# EAGLE design imu_v3 (EAGLE 5.11)
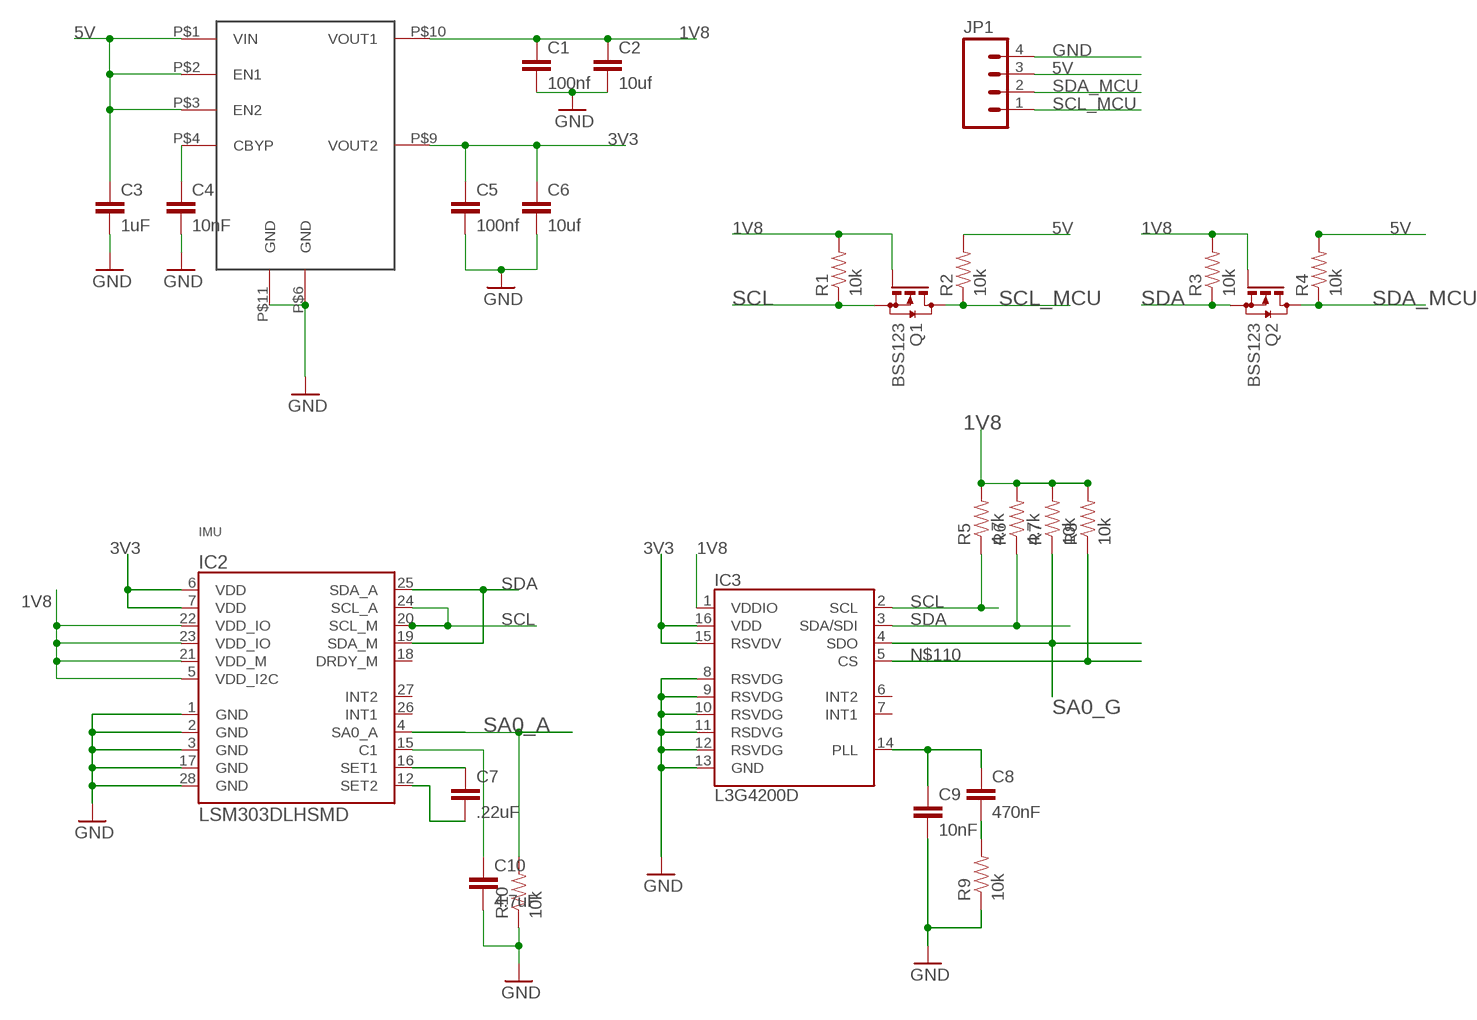
[diagram p0: schematic, sheet 1]

## Parts
C1  100nf  CAP0805  [0805]
C2  10uf  CAP0805  [0805]
C3  1uF  CAP0805  [0805]
C4  10nF  CAP0805  [0805]
C5  100nf  CAP0805  [0805]
C6  10uf  CAP0805  [0805]
C7  .22uF  CAP0805  [0805]
C8  470nF  CAP0805  [0805]
C9  10nF  CAP0805  [0805]
C10  4.7uF  CAP0805  [0805]
IC1  LP5996  [LLP-10]
IC2  LSM303DLHSMD  [LGA28-5X5]
IC3  L3G4200D  [LGA16-4X4]
JP1  M04PTH  [1X04]
Q1  BSS123  [SOT23]
Q2  BSS123  [SOT23]
R1  10k  RESISTOR0805-RES  [0805]
R2  10k  RESISTOR0805-RES  [0805]
R3  10k  RESISTOR0805-RES  [0805]
R4  10k  RESISTOR0805-RES  [0805]
R5  4.7k  RESISTOR0805-RES  [0805]
R6  4.7k  RESISTOR0805-RES  [0805]
R7  10k  RESISTOR0805-RES  [0805]
R8  10k  RESISTOR0805-RES  [0805]
R9  10k  RESISTOR0805-RES  [0805]
R10  10k  RESISTOR0805-RES  [0805]

## Nets
1V8: C1.1 C2.1 IC1.P$10(VOUT1) IC2.5(VDD_I2C) IC2.21(VDD_M) IC2.22(VDD_IO) IC2.23(VDD_IO) IC3.1(VDDIO) Q1.1(G) Q2.1(G) R1.2 R3.2 R5.2 R6.2 R7.2 R8.2
3V3: C5.1 C6.1 IC1.P$9(VOUT2) IC2.6(VDD) IC2.7(VDD) IC3.15(RSVDV) IC3.16(VDD)
5V: C3.1 IC1.P$1(VIN) IC1.P$2(EN1) IC1.P$3(EN2) JP1.3 R2.2 R4.2
GND: C1.2 C2.2 C3.2 C4.2 C5.2 C6.2 C9.2 C10.2 IC1.P$6(GND) IC1.P$11(GND) IC2.1(GND) IC2.2(GND) IC2.3(GND) IC2.17(GND) IC2.28(GND) IC3.8(RSVDG) IC3.9(RSVDG) IC3.10(RSVDG) IC3.11(RSDVG) IC3.12(RSVDG) IC3.13(GND) JP1.4 R9.1 R10.1
N$1: C10.1 IC2.15(C1)
N$97: C7.1 IC2.16(SET1)
N$98: C7.2 IC2.12(SET2)
N$102: C8.1 C9.1 IC3.14(PLL)
N$103: C8.2 R9.2
N$109: C4.1 IC1.P$4(CBYP)
N$110: IC3.5(CS) R8.1
SA0_A: IC2.4(SA0_A) R10.2
SA0_G: IC3.4(SDO) R7.1
SCL: IC2.20(SCL_M) IC2.24(SCL_A) IC3.2(SCL) Q1.2(S) R1.1 R5.1
SCL_MCU: JP1.1 Q1.3(D) R2.1
SDA: IC2.19(SDA_M) IC2.25(SDA_A) IC3.3(SDA/SDI) Q2.2(S) R3.1 R6.1
SDA_MCU: JP1.2 Q2.3(D) R4.1
Unconnected: IC2.18(DRDY_M) IC2.26(INT1) IC2.27(INT2) IC3.6(INT2) IC3.7(INT1)

## Notes on the sheet
- IMU

## Library data of the parts
C1-C10 = SparkFun:CAP: Capacitor Standard 0603 ceramic capacitor, and 0.1" leaded capacitor.
IC1 = pcbqr:LP5996
IC2 = imu:LSM303DLH
IC3 = SparkFun:L3G4200D: L3G4200D Three-axis, digital output gyroscope The L3G4200D is a low-power three-axis angular rate sensor, has a full scale of ±250/±500/±2000 dps and is capable of measuring rates with a user-selectable bandwidth. It includes a sensing element and an IC interface capable of providing the measured angular rate to the external world through a digital interface (I2C/SPI). Package: 4x4x1.1 LGA-16 (LGA16-4x4.PAC)
JP1 = SparkFun:M04: Header 4 Standard 4-pin 0.1" header. Use with straight break away headers (SKU : PRT-00116), right angle break away headers (PRT-00553), swiss pins (PRT-00743), machine pins (PRT-00117), and female headers (PRT-00115). Molex polarized connector foot print use with SKU : PRT-08231 with associated crimp pins and housings.
Q1 Q2 = transistor-small-signal:BSS123: N-CHANNEL MOS FET
R1-R10 = SparkFun:RESISTOR: Resistor Basic schematic elements and footprints for 0603, 1206, and PTH resistors.

## Net classes
1 power: width 0.406 mm

## Board
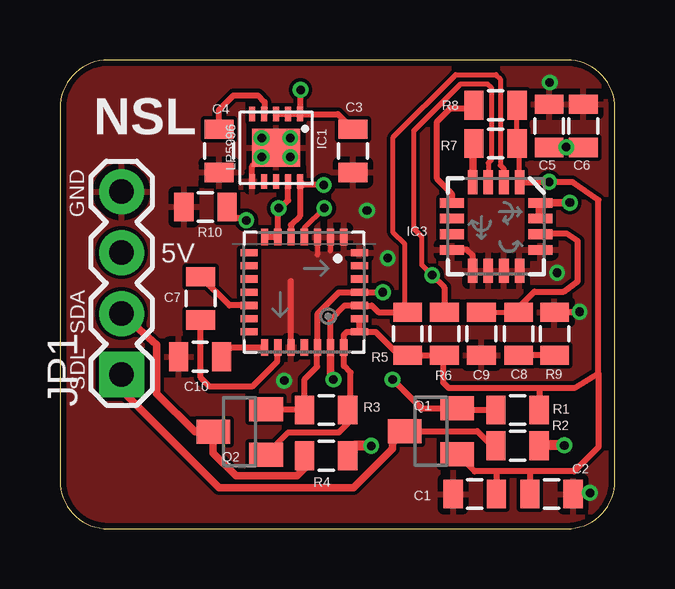
[diagram p1: board, top side]
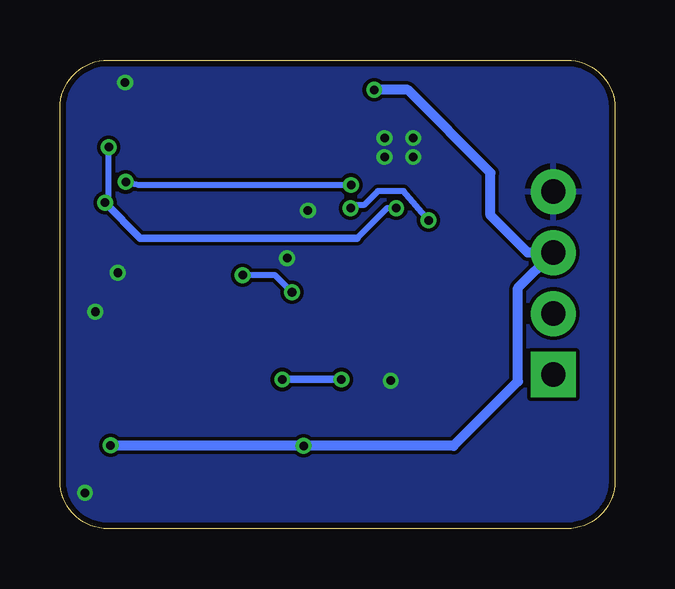
[diagram p2: board, bottom side, seen from below]

Size 23.14 x 19.53 mm. Coordinates in mm from the lower left corner, seen from the top.
Outline: 23.14,17.53 arc90 21.14,19.53 2,19.53 arc90 0,17.53 0,2 arc90 2,0 21.14,0 arc90 23.14,2 23.14,17.53
Copper layers (1*16): Top 0.035mm / dielectric 1.5mm / Bottom 0.035mm
Design rules "ITead_rule": minimum track width 6mil, minimum drill 12mil, track to track 6mil, track to pad 6mil, pad to pad 6mil, via to via 6mil, smd to smd 0mil, copper to edge 10mil, drill to drill 10mil, minimum pad ring 10mil, minimum via ring 6mil, stop-mask expansion 2mil, vias tented up to drill 100mil, thermal gap 10mil

### Footprints (pad centres in the part's own frame; a part is rotated, then mirrored left to right if it is on the bottom)
0805 = smd 0.8 x 1.2: 1 -0.9,0; 2 0.9,0
LLP-10 = smd 0.25 x 0.6: P$1 -1,-1.4; P$2 -0.5,-1.4; P$3 0,-1.4; P$4 0.5,-1.4; P$5 1,-1.4; P$6 1,1.4; P$7 0.5,1.4; P$8 0,1.4; P$9 -0.5,1.4; P$10 -1,1.4 | smd 2 x 1.6: P$11 0,0
LGA28-5X5 = smd 0.7 x 0.3: 1 -2.3,1.65; 2 -2.3,1.1; 3 -2.3,0.55; 4 -2.3,0; 5 -2.3,-0.55; 6 -2.3,-1.1; 7 -2.3,-1.65; 15 2.3,-1.65; 16 2.3,-1.1; 17 2.3,-0.55; 18 2.3,0; 19 2.3,0.55; 20 2.3,1.1; 21 2.3,1.65 | smd 0.3 x 0.7: 8 -1.65,-2.3; 9 -1.1,-2.3; 10 -0.55,-2.3; 11 0,-2.3; 12 0.55,-2.3; 13 1.1,-2.3; 14 1.65,-2.3; 22 1.65,2.3; 23 1.1,2.3; 24 0.55,2.3; 25 0,2.3; 26 -0.55,2.3; 27 -1.1,2.3; 28 -1.65,2.3
LGA16-4X4 = smd 1 x 0.4: 1 -1.85,0.975; 2 -1.85,0.325; 3 -1.85,-0.325; 4 -1.85,-0.975; 9 1.85,-0.975; 10 1.85,-0.325; 11 1.85,0.325; 12 1.85,0.975 | smd 0.4 x 1: 5 -0.975,-1.85; 6 -0.325,-1.85; 7 0.325,-1.85; 8 0.975,-1.85; 13 0.975,1.85; 14 0.325,1.85; 15 -0.325,1.85; 16 -0.975,1.85
1X04 = drill 1.016 pad 1.88 square: 1 0,0 | drill 1.016 pad 1.88 round: 2 2.54,0; 3 5.08,0; 4 7.62,0
SOT23 = smd 1 x 1.4: 1 -0.95,-1.1; 2 0.95,-1.1; 3 0,1.1

### Placement (x,y rotation side)
C1  17.3,1.45 180 top
C2  20.5,1.45 0 top
C3  12.22,15.75 270 top
C4  6.63,15.75 270 top
C5  20.4,16.79 90 top
C6  21.82,16.79 90 top
C7  5.87,9.6 90 top
C8  19.13,8.13 270 top
C9  17.58,8.13 270 top
C10  5.84,7.16 180 top
IC1  9.02,15.87 180 top
IC2  10.19,9.86 270 top
IC3  18.19,12.6 270 top
JP1  2.57,6.43 90 top
Q1  15.47,4.06 90 top
Q2  7.49,4.04 90 top
R1  19.08,4.95 0 top
R2  19.08,3.45 0 top
R3  11.1,4.95 0 top
R4  11.1,3.05 0 top
R5  14.5,8.13 270 top
R6  16.03,8.13 270 top
R7  18.16,16.05 0 top
R8  18.16,17.65 0 top
R9  20.62,8.13 270 top
R10  6.07,13.41 0 top

### Tracks (layer width: path | path; a pad name or v marks a point on that pad's centre or on a via)
1V8  (via drill 0.36)
  Top 0.203: IC3.1 19.16,15.95 R7.2 R8.2 19.08,17.67 | IC2.23 12.5,8.74 | IC2.5 9.63,12.16
  Top 0.254: IC2.22 11.96,8.21 11.84,8.08 IC2.21 11.84,6.78 12.12,6.5 12.12,4.95 R3.2 | IC2.22 IC2.23 | IC2.22 12.51,8.18 12.54,8.2 13.16,8.2 14.13,7.23 R5.2 R6.2 15.98,7.18 15.98,6.1 16.21,5.87 19.99,5.87 | 19.99,5.87 21.46,5.87 22.45,6.48 | 22.45,6.48 22.45,13.69 21.37,14.45 IC3.1 19.99,14.45 v20.4,14.45 | R1.2 19.99,4.96 19.99,5.87 | Q1.1 17.3,2.39 18.16,2.39 | 19.61,2.39 21.44,2.39 22.45,3.4 22.45,6.48 | 19.61,2.39 18.16,2.39 | R3.2 12,4.48 | Q2.1 9.52,4.01 11.63,4.01 12,4.38 R3.2 | C1.1 18.2,2.35 18.16,2.39 | C2.1 19.6,2.38 19.61,2.39 | IC2.5 9.64,12.66 10.01,13.03 IC1.P$10 10.17,14.33 v11,14.33
  Bottom 0.254: v11,14.33 19.86,14.33 v20.4,14.45
3V3  (via drill 0.36)
  Top 0.203: IC2.6 9.09,12.16
  Top 0.254: IC2.7 IC2.6 9.09,13.33 | C6.1 21.12,15.89 v21.11,15.9 21.1,15.89 C5.1 | 9.12,13.28 9.52,13.68 IC1.P$9 | 9.12,13.28 9.09,13.26 | 9.09,13.33 v9.12,13.36 | 9.09,13.33 9.12,13.29 9.12,13.28
  Top 0.305: IC3.16 20.05,13.59 v21.26,13.59
  Top 0.406: IC3.16 IC3.15
  Bottom 0.254: v21.11,15.9 21.11,13.74 v21.26,13.59 | 10.74,12.12 9.5,13.36 v9.12,13.36
  Bottom 0.305: v21.26,13.59 19.79,12.12 10.74,12.12
5V  (via drill 0.36)
  Top 0.203: C3.1 11.87,16.51
  Top 0.254: v10.03,18.29 10.02,18.27 IC1.P$1 | IC1.P$1 11.59,17.27 C3.1 | IC1.P$3 IC1.P$2 IC1.P$1
  Top 0.406: R2.2 20.03,3.48 v21.03,3.48 | v12.98,3.45 12.25,3.45 arc90 R4.2
  Bottom 0.406: v21.03,3.48 21.01,3.45 v12.98,3.45 6.73,3.45 4.04,6.15 4.04,10.03 JP1.3 3.63,11.51 5.18,13.06 5.18,14.83 8.64,18.29 v10.03,18.29
GND  (via drill 0.36)
  Top 0.203: 10.72,11.4 10.74,11.42 IC2.3 | 11.28,12.06 11.28,11.58
  Top 0.254: IC2.17 9.64,10.32 | IC3.8 16.35,11.63 16.97,11.63 17.21,11.39 IC3.9 | 11.28,12.06 11.29,12.07 IC2.2 | v21.67,9.04 R9.1 | IC1.P$6 8.02,15.1 v8.41,15.49
  other vias: 20.73,10.67 13.67,11.28 8.41,16.28 9.6,16.28 9.6,15.49 20.42,18.59 22.1,1.5 12.8,13.26 9.35,6.17
  pour Bottom: -0.08,19.76 23.27,19.91 23.32,-0.18 -0.03,-0.33
  pour Top: -0.43,19.96 23.37,19.94 23.37,-0.41 -0.43,-0.38
N$1
  Top 0.254: C10.1 7.13,7.55 IC2.15
N$97
  Top 0.254: C7.1 5.87,6.3 6.25,5.92 8,5.92 9.07,6.98 9.07,7.54 IC2.16
N$98
  Top 0.254: C7.2 7.06,9.3 IC2.12
N$102
  Top 0.203: C9.1 C8.1
  Top 0.254: IC3.14 20.06,12.29 21.13,12.29 21.59,11.99 21.59,10.31 21.01,9.88 19.79,9.88 19.13,9.22 C8.1 19.13,9.09
N$103
  Top 0.254: R9.2 C8.2
N$109
  Top 0.254: IC1.P$4 8.53,17.29 8.53,17.78 8.26,18.06 7.24,18.06 6.63,17.45 C4.1
N$110
  Top 0.203: 17.18,17.58 R8.1 | IC3.5 16.34,13.79
  Top 0.254: IC3.5 16.34,13.97 15.72,14.58 15.72,16.97 16.28,17.53 17.13,17.53 17.18,17.58
SA0_A  (via drill 0.36)
  Top 0.203: R10.2 7.11,13.27 7.11,12.98 7.14,12.95 7.16,12.93 | IC2.4 10.19,12.52 v11.02,13.36
  Top 0.254: v7.77,12.85 7.65,12.95 7.14,12.95
  Bottom 0.254: v7.77,12.85 8.81,14.07 9.88,14.07 10.46,13.49 10.9,13.49 v11.02,13.36
SA0_G
  Top 0.305: R7.1 17.21,16.05 IC3.4
SCL  (via drill 0.36)
  Top 0.203: 14.55,9.08 R5.1 14.38,9.15 14.38,11.86 13.89,12.34 13.89,16.31 16.51,18.92 18.19,18.92 18.36,18.74 18.36,15.14 18.51,14.99 IC3.2
  Top 0.254: R5.1 13.27,9.03 13,9.3 12.49,9.3 IC2.24 11.87,9.3 11.28,8.71 11.28,7.56 IC2.20 | v13.87,6.22 15.08,5.01 Q1.2 16.63,4.95 R1.1
  Top 0.305: IC2.20 11.28,6.22 v11.4,6.22
  Bottom 0.305: v11.4,6.22 v13.87,6.22
SCL_MCU
  Top 0.254: Q1.3 17.4,4.06 18.01,3.45 R2.1
  Top 0.305: Q1.3 13.87,3.56 13.87,3.33 12.24,1.7 6.63,1.7 2.69,5.64 2.69,6.38 JP1.1
SDA  (via drill 0.36)
  Top 0.203: R6.1 15.62,9.03 | IC3.3 17.86,15.24 17.98,15.37 17.98,18.39 17.83,18.54 16.71,18.54 14.76,16.59 14.76,12.5 15.09,12.17 15.09,11 v15.52,10.57
  Top 0.254: v13.46,9.86 IC2.25 11.63,9.86 10.74,8.97 10.74,7.56 IC2.19 10.72,7.54 10.72,6.76 10.2,6.24 R3.1 8.63,4.95 Q2.2 | v15.52,10.57 16.03,10.06 R6.1
  Bottom 0.254: v13.46,9.86 14.17,10.57 v15.52,10.57
SDA_MCU
  Top 0.305: R4.1 10.2,2.53 9.88,2.21 7.34,2.21 6.39,3.16 Q2.3 5.63,4.04 4.04,5.63 4.04,7.67 JP1.2

### Text on the board
tPlace: NSL | GND | 5V | SDA | SDL